# EAGLE schematic MPX_4067 (EAGLE 9.5.2)
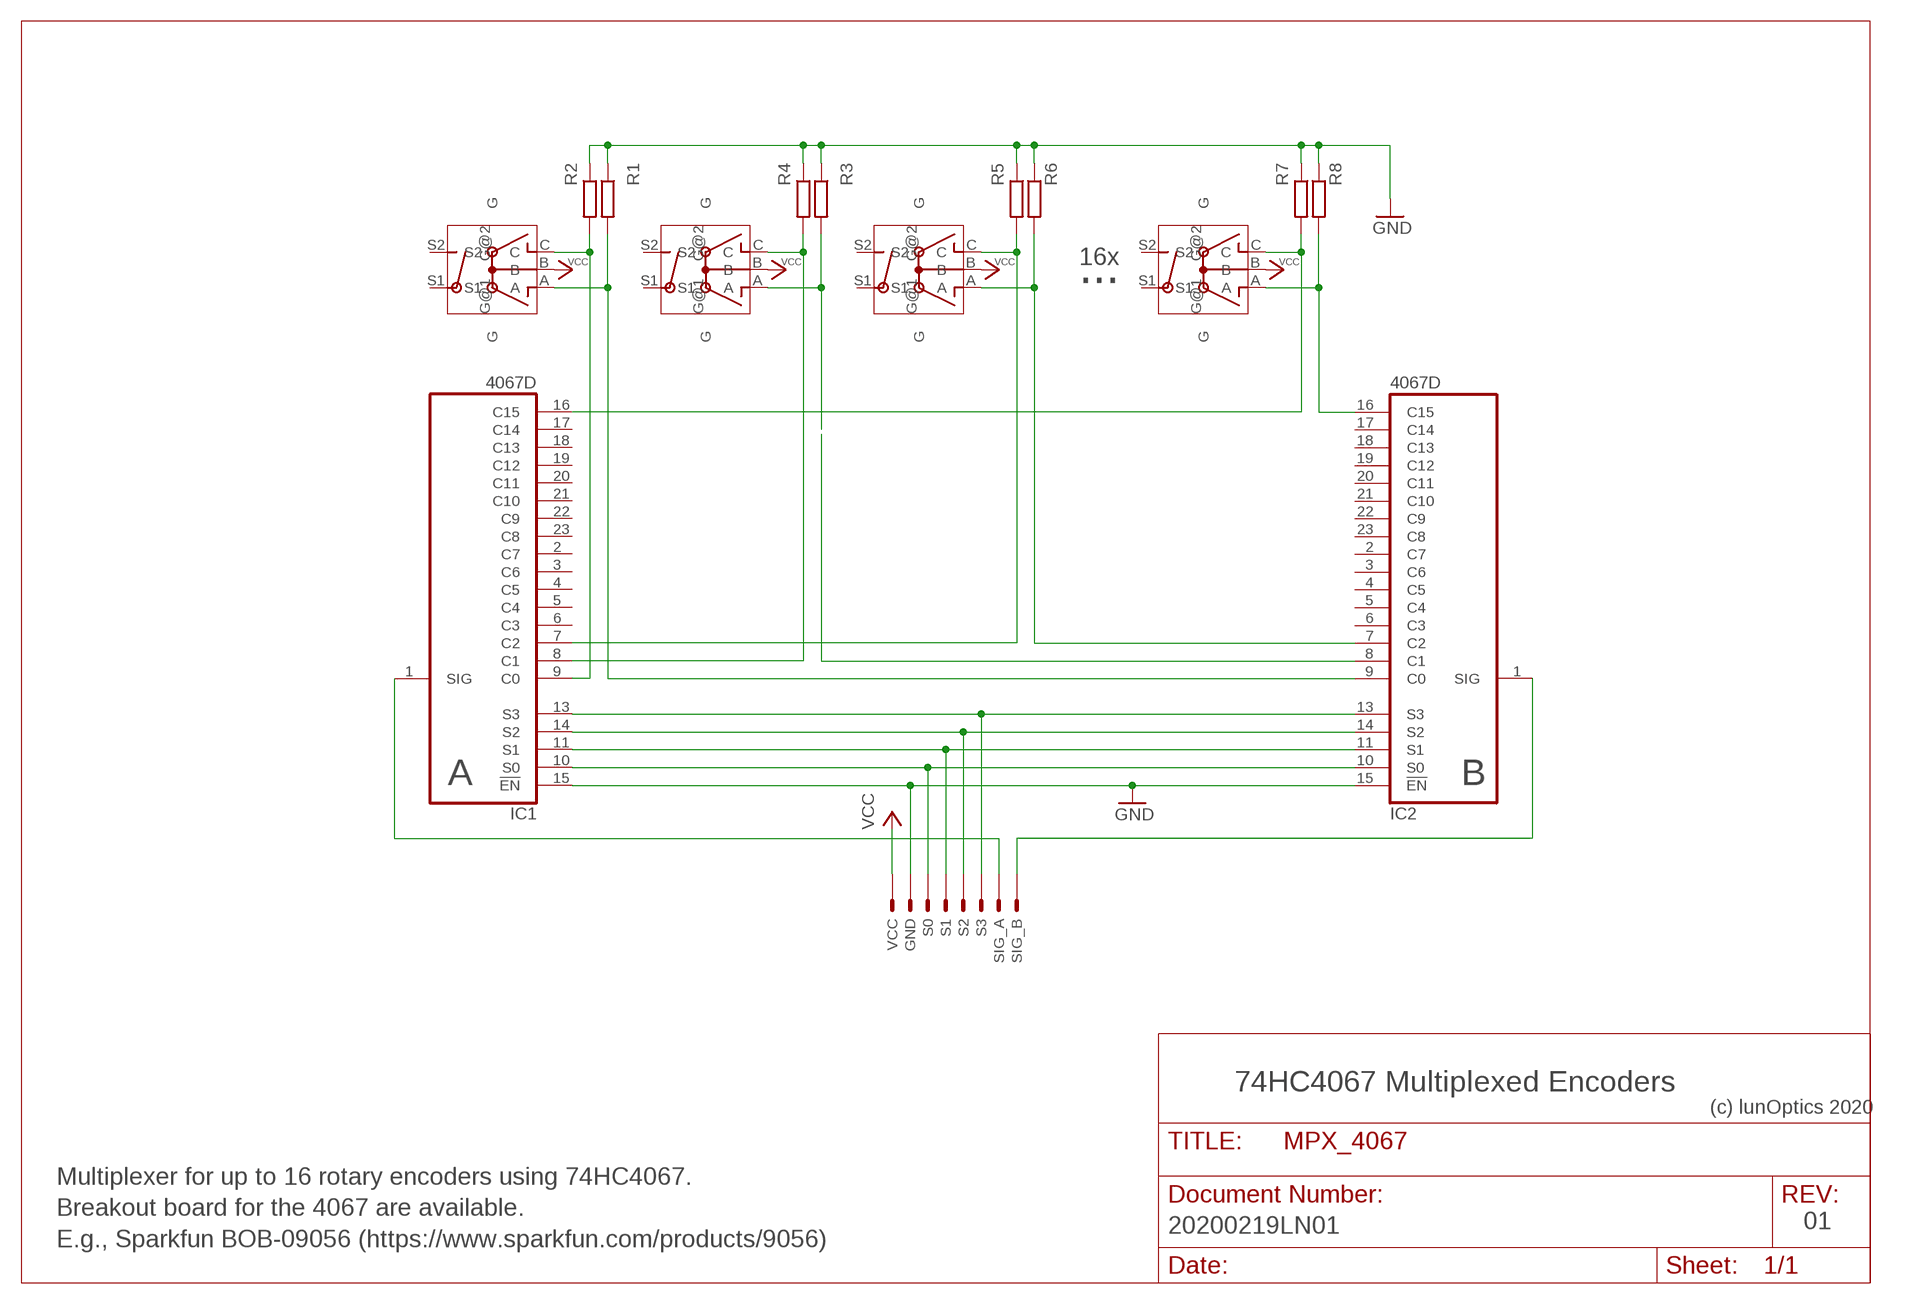
[diagram p0: schematic, sheet 1]

## Parts
EN1  ENCODER  [ENCODER]
EN2  ENCODER  [ENCODER]
EN3  ENCODER  [ENCODER]
EN4  ENCODER  [ENCODER]
IC1  4067D  [SO24W]
IC2  4067D  [SO24W]
R1  R-EU_0204/7  [0204/7]
R2  R-EU_0204/7  [0204/7]
R3  R-EU_0204/7  [0204/7]
R4  R-EU_0204/7  [0204/7]
R5  R-EU_0204/7  [0204/7]
R6  R-EU_0204/7  [0204/7]
R7  R-EU_0204/7  [0204/7]
R8  R-EU_0204/7  [0204/7]
X1  057-010-0  [057-010-0]

## Nets
GND: IC1.15(!EN) IC2.15(!EN) R1.1 R2.1 R3.1 R4.1 R5.1 R6.1 R7.1 R8.1 X1.2
N$1: IC1.10(S0) IC2.10(S0) X1.3
N$2: IC2.1(SIG) X1.8
N$3: EN1.C IC1.9(C0) R2.2
N$4: EN1.A IC2.9(C0) R1.2
N$5: EN2.C IC1.8(C1) R4.2
N$6: EN2.A R3.2
N$7: EN3.C IC1.7(C2) R5.2
N$8: EN3.A IC2.7(C2) R6.2
N$9: IC2.8(C1)
N$10: EN4.C IC1.16(C15) R7.2
N$11: EN4.A IC2.16(C15) R8.2
N$12: IC1.1(SIG) X1.7
N$13: IC1.11(S1) IC2.11(S1) X1.4
N$14: IC1.14(S2) IC2.14(S2) X1.5
N$15: IC1.13(S3) IC2.13(S3) X1.6
VCC: EN1.B EN2.B EN3.B EN4.B X1.1
Unconnected: EN1.G@1(G) EN1.G@2(G) EN1.S1 EN1.S2 EN2.G@1(G) EN2.G@2(G) EN2.S1 EN2.S2 EN3.G@1(G) EN3.G@2(G) EN3.S1 EN3.S2 EN4.G@1(G) EN4.G@2(G) EN4.S1 EN4.S2 IC1.2(C7) IC1.3(C6) IC1.4(C5) IC1.5(C4) IC1.6(C3) IC1.17(C14) IC1.18(C13) IC1.19(C12) IC1.20(C11) IC1.21(C10) IC1.22(C9) IC1.23(C8) IC2.2(C7) IC2.3(C6) IC2.4(C5) IC2.5(C4) IC2.6(C3) IC2.17(C14) IC2.18(C13) IC2.19(C12) IC2.20(C11) IC2.21(C10) IC2.22(C9) IC2.23(C8) X1.9 X1.10

## Notes on the sheet
- 16x
- ...
- A | B
- VCC | GND | S0 | S1 | S2 | S3 | SIG_A | SIG_B
- 74HC4067 Multiplexed Encoders
- (c) lunOptics 2020
- 20200219LN01 | 01
- Multiplexer for up to 16 rotary encoders using 74HC4067. 
  Breakout board for the 4067 are available.
  E.g., Sparkfun BOB-09056 (https://www.sparkfun.com/products/9056)

## Power pins joined to a net without a drawn wire
VDD: IC1.24(VDD) IC2.24(VDD)
VSS: IC1.12(VSS) IC2.12(VSS)

## Library data of the parts
EN1-EN4 = misc:ENCODER
IC1 IC2 = my40xx:4067: 16-channel ANALOG MULTIPLEXER
R1-R8 = rcl:R-EU_: RESISTOR, European symbol; SPICEPREFIX: R
X1 = con-panduit:057-010-: CONNECTOR 10-pin series 057 contact pc board low profile headers; OC_FARNELL: unknown; OC_NEWARK: unknown